# Altium schematic sheet Driver.SchDoc
size 420 x 297 mm
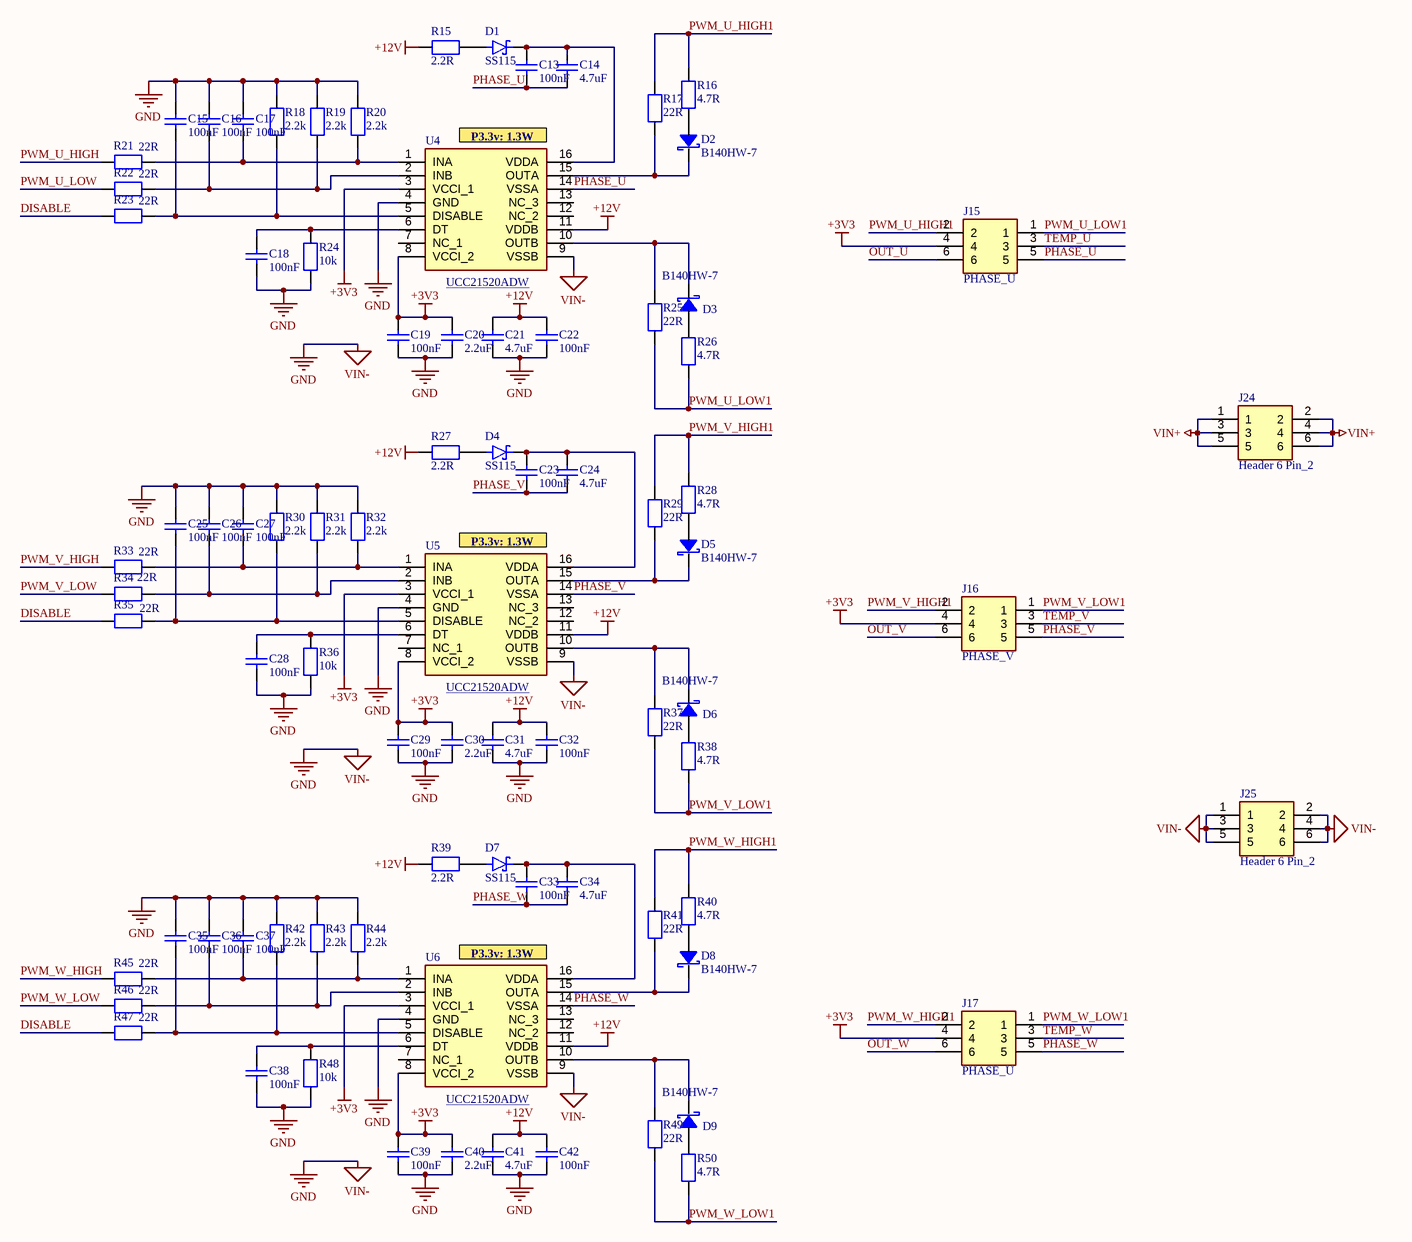
[diagram p0: Driver.SchDoc]

## Parts
C13  100nF  [C0603]
C14  4.7uF  [C0603]
C15  100nF  [C0603]
C16  100nF  [C0603]
C17  100nF  [C0603]
C18  100nF  [C0603]
C19  100nF  [C0603]
C20  2.2uF  [C0603]
C21  4.7uF  [C0603]
C22  100nF  [C0603]
C23  100nF  [C0603]
C24  4.7uF  [C0603]
C25  100nF  [C0603]
C26  100nF  [C0603]
C27  100nF  [C0603]
C28  100nF  [C0603]
C29  100nF  [C0603]
C30  2.2uF  [C0603]
C31  4.7uF  [C0603]
C32  100nF  [C0603]
C33  100nF  [C0603]
C34  4.7uF  [C0603]
C35  100nF  [C0603]
C36  100nF  [C0603]
C37  100nF  [C0603]
C38  100nF  [C0603]
C39  100nF  [C0603]
C40  2.2uF  [C0603]
C41  4.7uF  [C0603]
C42  100nF  [C0603]
D1  SS115  [DIOM4325X250N]
D2  B140HW-7  [SOD123]
D3  B140HW-7  [SOD123]
D4  SS115  [DIOM4325X250N]
D5  B140HW-7  [SOD123]
D6  B140HW-7  [SOD123]
D7  SS115  [DIOM4325X250N]
D8  B140HW-7  [SOD123]
D9  B140HW-7  [SOD123]
J15  PHASE_U  [61300621121]
J16  PHASE_V  [61300621121]
J17  PHASE_U  [61300621121]
J24  Header 6 Pin_2  [61300621121]
J25  Header 6 Pin_2  [61300621121]
R15  2.2R  [R0603]
R16  4.7R  [R0603]
R17  22R  [R0603]
R18  2.2k  [R0603]
R19  2.2k  [R0603]
R20  2.2k  [R0603]
R21  22R  [R0603]
R22  22R  [R0603]
R23  22R  [R0603]
R24  10k  [R0603]
R25  22R  [R0603]
R26  4.7R  [R0603]
R27  2.2R  [R0603]
R28  4.7R  [R0603]
R29  22R  [R0603]
R30  2.2k  [R0603]
R31  2.2k  [R0603]
R32  2.2k  [R0603]
R33  22R  [R0603]
R34  22R  [R0603]
R35  22R  [R0603]
R36  10k  [R0603]
R37  22R  [R0603]
R38  4.7R  [R0603]
R39  2.2R  [R0603]
R40  4.7R  [R0603]
R41  22R  [R0603]
R42  2.2k  [R0603]
R43  2.2k  [R0603]
R44  2.2k  [R0603]
R45  22R  [R0603]
R46  22R  [R0603]
R47  22R  [R0603]
R48  10k  [R0603]
R49  22R  [R0603]
R50  4.7R  [R0603]
U4  UCC21520ADW  [SOIC127P1030X265-16N]
U5  UCC21520ADW  [SOIC127P1030X265-16N]
U6  UCC21520ADW  [SOIC127P1030X265-16N]

## Nets
+3V3: C19.2 C20.2 C29.2 C30.2 C39.2 C40.2 J15.4 J16.4 J17.4 U4.3(VCCI_1) U4.8(VCCI_2) U5.3(VCCI_1) U5.8(VCCI_2) U6.3(VCCI_1) U6.8(VCCI_2)
+12V: C21.2 C22.2 C31.2 C32.2 C41.2 C42.2 R15.1 R27.1 R39.1 U4.11(VDDB) U5.11(VDDB) U6.11(VDDB)
GND: C15.2 C16.2 C17.2 C18.1 C19.1 C20.1 C21.1 C22.1 C25.2 C26.2 C27.2 C28.1 C29.1 C30.1 C31.1 C32.1 C35.2 C36.2 C37.2 C38.1 C39.1 C40.1 C41.1 C42.1 J25.1 J25.2 J25.3 J25.4 J25.5 J25.6 R18.2 R19.2 R20.2 R24.1 R30.2 R31.2 R32.2 R36.1 R42.2 R43.2 R44.2 R48.1 U4.4(GND) U4.9(VSSB) U5.4(GND) U5.9(VSSB) U6.4(GND) U6.9(VSSB)  [also labelled VIN-]
VIN+: J24.1 J24.2 J24.3 J24.4 J24.5 J24.6
DISABLE: R23.1 R35.1 R47.1
OUT_U: J15.6
OUT_V: J16.6
OUT_W: J17.6
PHASE_U: C13.1 C14.1 J15.5 U4.14(VSSA)
PHASE_V: C23.1 C24.1 J16.5 U5.14(VSSA)
PHASE_W: C33.1 C34.1 J17.5 U6.14(VSSA)
PWM_U_HIGH: R21.1
PWM_U_HIGH1: J15.2 R16.2 R17.2
PWM_U_LOW: R22.1
PWM_U_LOW1: J15.1 R25.1 R26.1
PWM_V_HIGH: R33.1
PWM_V_HIGH1: J16.2 R28.2 R29.2
PWM_V_LOW: R34.1
PWM_V_LOW1: J16.1 R37.1 R38.1
PWM_W_HIGH: R45.1
PWM_W_HIGH1: J17.2 R40.2 R41.2
PWM_W_LOW: R46.1
PWM_W_LOW1: J17.1 R49.1 R50.1
TEMP_U: J15.3
TEMP_V: J16.3
TEMP_W: J17.3
NetC13_2: C13.2 C14.2 D1.C(K) U4.16(VDDA)
NetC15_1: C15.1 R18.1 R23.2 U4.5(DISABLE)
NetC16_1: C16.1 R19.1 R22.2 U4.2(INB)
NetC17_1: C17.1 R20.1 R21.2 U4.1(INA)
NetC18_2: C18.2 R24.2 U4.6(DT)
NetC23_2: C23.2 C24.2 D4.C(K) U5.16(VDDA)
NetC25_1: C25.1 R30.1 R35.2 U5.5(DISABLE)
NetC26_1: C26.1 R31.1 R34.2 U5.2(INB)
NetC27_1: C27.1 R32.1 R33.2 U5.1(INA)
NetC28_2: C28.2 R36.2 U5.6(DT)
NetC33_2: C33.2 C34.2 D7.C(K) U6.16(VDDA)
NetC35_1: C35.1 R42.1 R47.2 U6.5(DISABLE)
NetC36_1: C36.1 R43.1 R46.2 U6.2(INB)
NetC37_1: C37.1 R44.1 R45.2 U6.1(INA)
NetC38_2: C38.2 R48.2 U6.6(DT)
NetD1_A: D1.A R15.2
NetD2_A: D2.A R16.1
NetD2_C: D2.C R17.1 U4.15(OUTA)
NetD3_A: D3.A R26.2
NetD3_C: D3.C R25.2 U4.10(OUTB)
NetD4_A: D4.A R27.2
NetD5_A: D5.A R28.1
NetD5_C: D5.C R29.1 U5.15(OUTA)
NetD6_A: D6.A R38.2
NetD6_C: D6.C R37.2 U5.10(OUTB)
NetD7_A: D7.A R39.2
NetD8_A: D8.A R40.1
NetD8_C: D8.C R41.1 U6.15(OUTA)
NetD9_A: D9.A R50.2
NetD9_C: D9.C R49.2 U6.10(OUTB)

Not connected (* = marked no-connect by the designer): U4 7(NC_1) 12(NC_2) 13(NC_3); U5 7(NC_1) 12(NC_2) 13(NC_3); U6 7(NC_1) 12(NC_2) 13(NC_3)

## Notes on the sheet
- (near U4) P3.3v: 1.3W
- (near U5) P3.3v: 1.3W
- (near U6) P3.3v: 1.3W
- THIS DOCUMENT AND THE DATA DISCLOSED HEREIN OR
- HEREWITH IS THE PROPERTY OF ALTIUM LIMITED AND MAY
- DWG NO:
- REVISION
- REV:
- DESCRIPTION
- DATE
- APPROVED
- BE FREELY DISTRIBUTED IN WHOLE. NO RIGHTS ARE
- RESERVED OR EXPRESS OR IMPLIED WARANTEE GIVEN.
- ENG:
- APPROVALS
- PROJECT
- DSN:
- CHK:
- REFERENCE DOCUMENTS
- PROJECT REVISION:
- TITLE
- DOCUMENT REVISION:
- DESIGN ITEM:
- BOM:
- FAB DWG:
- PCB DWG:
- ASSY DWG:
- SCALE:
- A3
- SIZE
- CAGE CODE
- FILE NAME
- DWG NO.
- SHEET
- OF
- REV

## Library data of the parts
C13 C15-C19 C22 C23 C25-C29 C32 C33 C35-C39 C42 = 100nF ± 10% 50V: Manufacturer: Yageo; Manufacturer Part Number: CS0603KRX7R9BB104; Value: 100nF; Supplier: mouser; Supplier Part Number: 603-CS0603KRX79BB104; Price: 0.1
C14 C21 C24 C31 C34 C41 = 4.7uF ± 10% 50V: Manufacturer: Yageo; Manufacturer Part Number: GRM188R61H225ME11J; Value: 4.7uF; Supplier: mouser; Supplier Part Number: 81-GRM188R61H225ME1J; Price: 0.3
C20 C30 C40 = 2.2uF ± 10% 50V: Manufacturer: Yageo; Manufacturer Part Number: GRM188R61H225ME11J; Value: 2.2uF; Supplier: mouser; Supplier Part Number: 81-GRM188R61H225ME1J; Price: 0.3
D1 D4 D7 = SS115: Schottky Diodes & Rectifiers 1A, 150V, Schottky Rectifier; Manufacturer: Taiwan Semiconductor; Value: 1A, 150V; Price: 0.34; Supplier: Mouser; Manufacturer Part Number: SS115; Supplier Part Number: 821-SS115
D2 D3 D5 D6 D8 D9 = B140HW-7: Schottky Diodes & Rectifiers 1A, 40V; Value: B140HW-7; Manufacturer Part Number: B140HW-7; Manufacturer: Diodes; Supplier: Mouser; Supplier Part Number: 621-B140HW-7; Price: 0.42
J15-J17 J24 J25 = Header 6 Pin_2: WR-PHD 2.54mm  Dual Pin Header THT 06p Wurth Elektronik WR-PHD Series, Series Number 6130, 2.54mm Pitch 6 Way 2 Row Straight PCB Header, Solder Termination; Value: 61300621121; Supplier Part Number: 710-61300621121; Supplier: Mouser; Manufacturer: Wurth Elektronik; Manufacturer Part Number: 61300621121; Price: 0.57
R15 R27 R39 = 2.2ohm 0.1W ±1%: 2.2 ohm 0.1W ±1%; Manufacturer Part Number: RC0603FR-072R2L; Manufacturer: Yageo; Value: 2.2R; Supplier: Mouser; Supplier Part Number: 603-RC0603FR-072R2L; Price: 0.1
R16 R26 R28 R38 R40 R50 = 4.7ohm 0.1W ±10%: 4.7 ohm 0.1W ±1%; Manufacturer Part Number: RC1206FR-074R7L; Manufacturer: Yageo; Value: 4.7R; Supplier: Mouser; Supplier Part Number: 603-RC1206FR-074R7L; Price: 0.12
R17 R21-R23 R25 R29 R33-R35 R37 R41 R45-R47 R49 = 22ohm 0.1W ±1%: 22 ohm 0.1W ±1%; Manufacturer Part Number: RC0603FR-0722RL; Manufacturer: Yageo; Value: 22R; Supplier: Mouser; Supplier Part Number: 603-RC0603FR-0722RL; Price: 0.1
R18-R20 R30-R32 R42-R44 = 2.2 kOhms ±1% 0.1W: Manufacturer: Yageo; Manufacturer Part Number: RC0603FR-072K2L; Value: 2.2k; Supplier: Mouser; Supplier Part Number: 603-RC0603FR-072K2L; Price: 0.1
R24 R36 R48 = 10 kOhms ±1% 0.1W: Manufacturer: Yageo; Manufacturer Part Number: RC0603FR-0710KL; Value: 10k; Supplier: mouser; Supplier Part Number: 603-RC0603FR-0710KL; Price: 0.1
U4-U6 = UCC21520ADW: 4A/6A, 5.7 kVrms Isolated Dual Channel Gate Driver; Manufacturer: Texas Instruments; Supplier Part Number: 595-UCC21520ADW; Value: UCC21520ADW; Manufacturer Part Number: UCC21520ADW; Price: 7.6; Supplier: Mouser